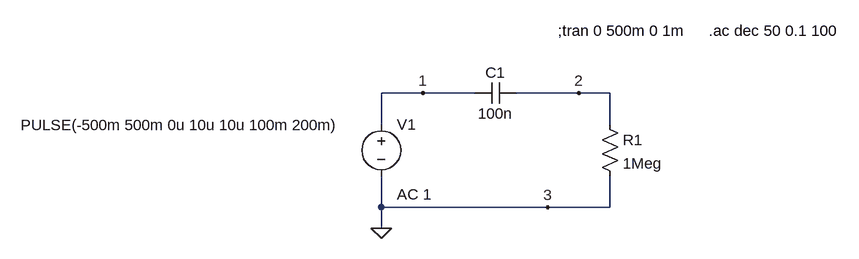
[diagram p0: schematic Hochpass.asc]
Hochpass.asc, the LTspice schematic file:
Version 4
SHEET 1 880 680
WIRE 32 64 -32 64
WIRE 112 64 32 64
WIRE 272 64 176 64
WIRE 320 64 272 64
WIRE -32 112 -32 64
WIRE 320 112 320 64
WIRE -32 240 -32 192
WIRE 224 240 -32 240
WIRE 320 240 320 192
WIRE 320 240 224 240
WIRE -32 272 -32 240
FLAG -32 272 0
FLAG 32 64 1
FLAG 272 64 2
FLAG 224 240 3
SYMBOL cap 176 48 R90
WINDOW 0 0 32 VBottom 2
WINDOW 3 32 32 VTop 2
SYMATTR InstName C1
SYMATTR Value 100n
SYMBOL res 304 96 R0
SYMATTR InstName R1
SYMATTR Value 1Meg
SYMBOL voltage -32 96 R0
WINDOW 3 -555 17 Left 2
WINDOW 123 24 124 Left 2
WINDOW 39 0 0 Left 0
SYMATTR InstName V1
SYMATTR Value PULSE(-500m 500m 0u 10u 10u 100m 200m)
SYMATTR Value2 AC 1
TEXT 240 -32 Left 2 !;tran 0 500m 0 1m
TEXT 472 -32 Left 2 !.ac dec 50 0.1 100

The netlist it stands for:
* Hochpass.asc
C1 2 1 100n
R1 2 0 1Meg
V1 1 0 PULSE(-500m 500m 0u 10u 10u 100m 200m) AC 1
;tran 0 500m 0 1m
.ac dec 50 0.1 100
.backanno
.end